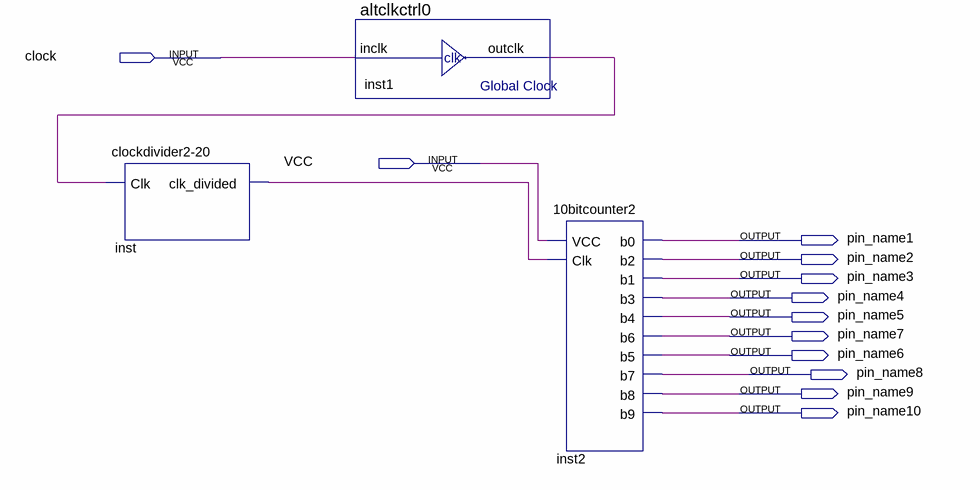
[diagram p0: schematic sheet]
// Quartus schematic Blinkenlights.bdf as structural Verilog: 3 symbols, 12 pins
module Blinkenlights (
  input  clock,
  input  VCC,
  output pin_name1,
  output pin_name2,
  output pin_name3,
  output pin_name4,
  output pin_name5,
  output pin_name7,
  output pin_name6,
  output pin_name8,
  output pin_name9,
  output pin_name10
);

  wire inst1_outclk, inst_clk_divided;

  \clockdivider2-20  inst (.Clk(inst1_outclk), .clk_divided(inst_clk_divided));
  altclkctrl0 inst1 (.inclk(clock), .outclk(inst1_outclk));
  \10bitcounter2  inst2 (
    .VCC(VCC), .Clk(inst_clk_divided), .b0(pin_name1), .b2(pin_name2), .b1(pin_name3), .b3(pin_name4),
    .b4(pin_name5), .b6(pin_name7), .b5(pin_name6), .b7(pin_name8), .b8(pin_name9), .b9(pin_name10));
endmodule
